# EAGLE design AmpSwitchAutomatic_control (EAGLE 6.0)
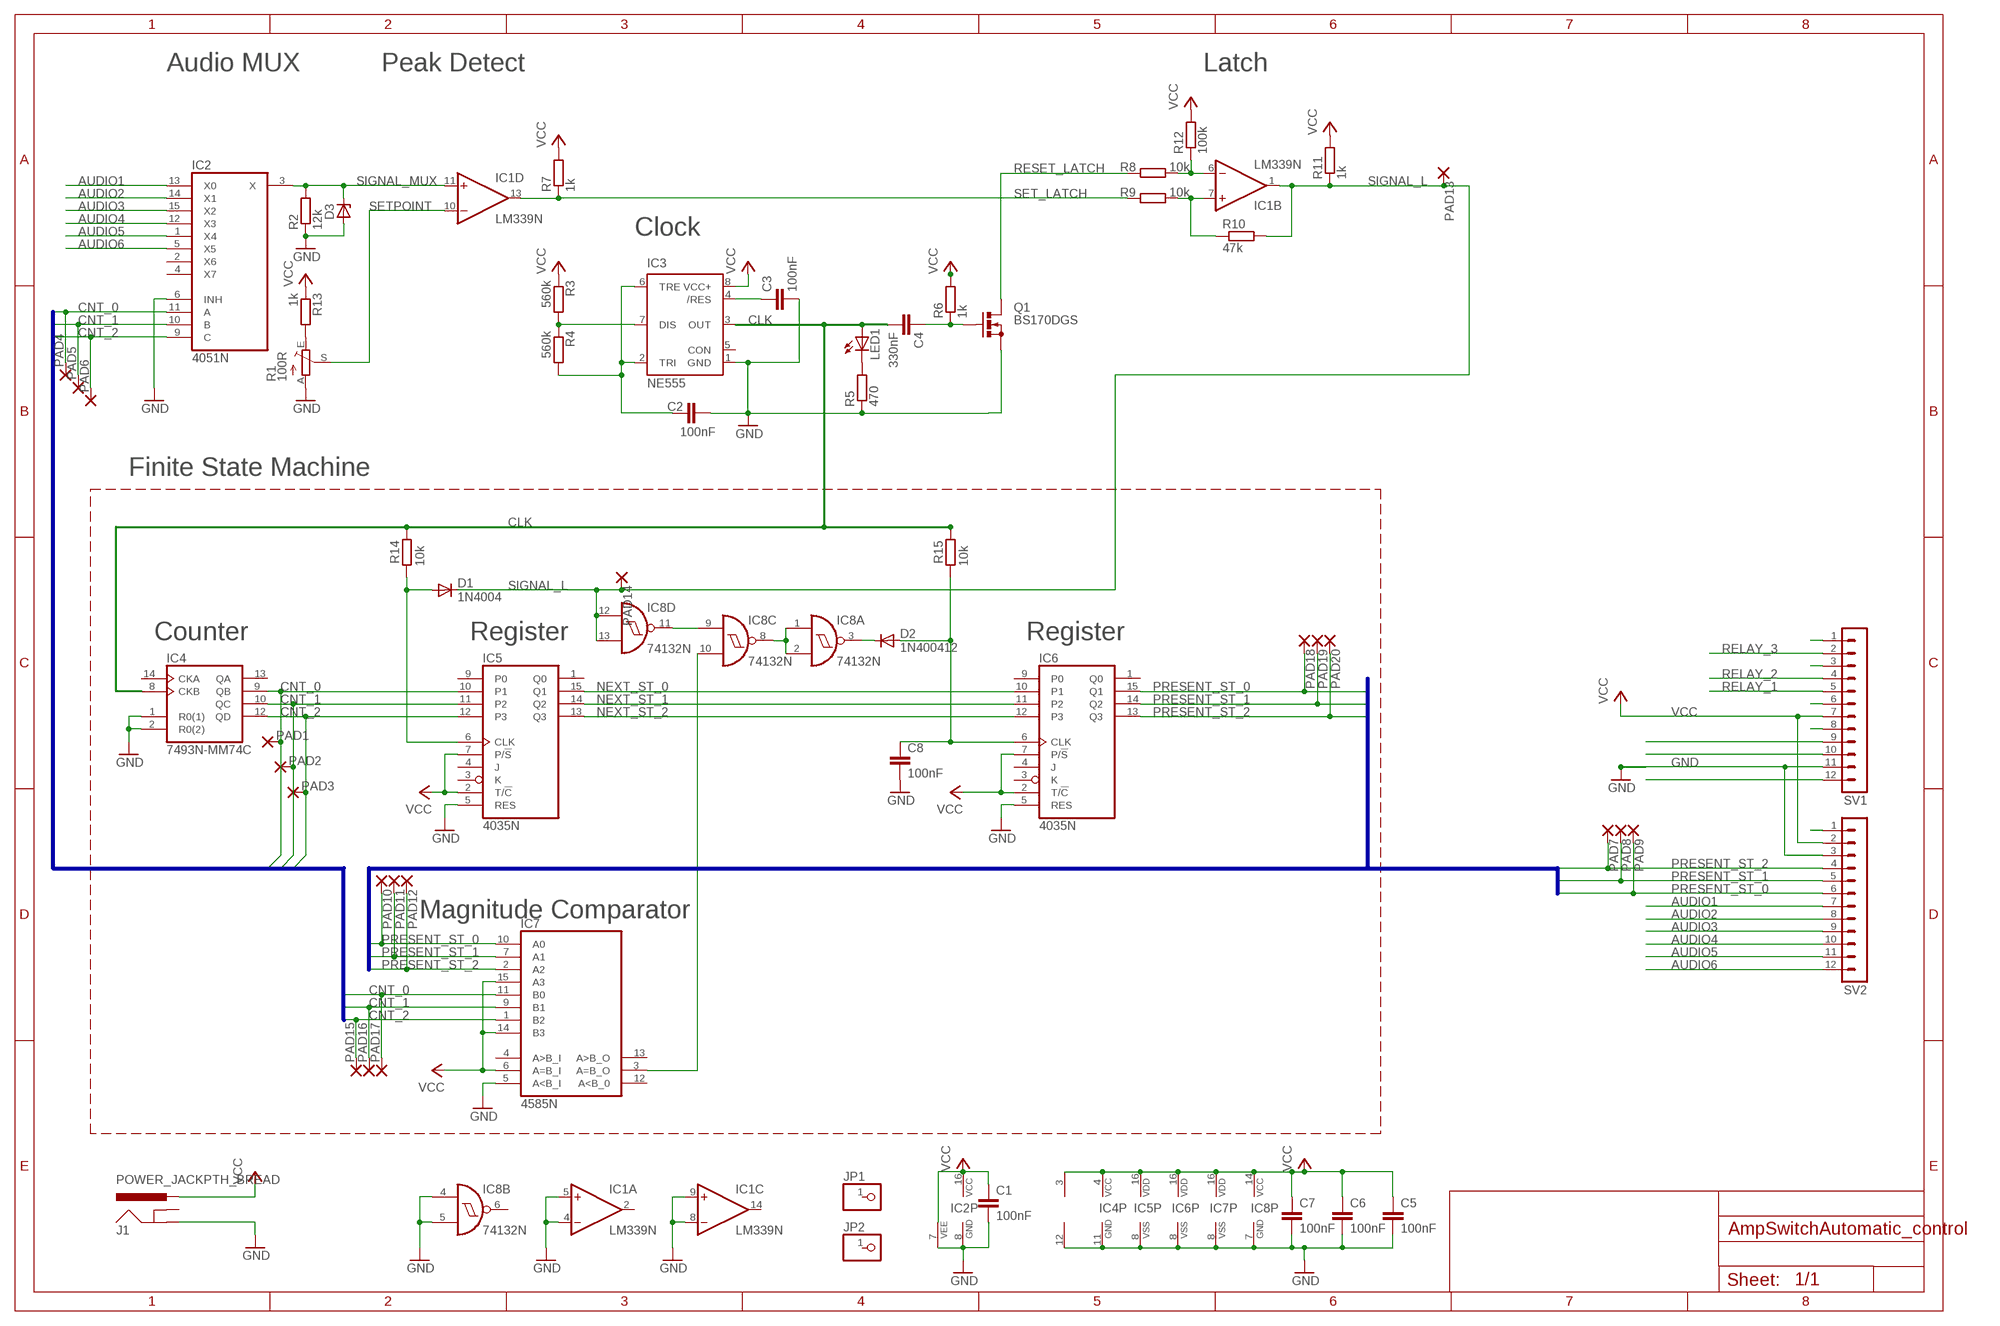
[diagram p0: schematic, sheet 1]

## Parts
C1  100nF  C-EU025-025X050  [C025-025X050]
C2  100nF  C-EU025-024X044  [C025-024X044]
C3  100nF  C-EU025-024X044  [C025-024X044]
C4  330nF  C-EU075-032X103  [C075-032X103]
C5  100nF  C-EU025-025X050  [C025-025X050]
C6  100nF  C-EU025-025X050  [C025-025X050]
C7  100nF  C-EU025-025X050  [C025-025X050]
C8  100nF  C-EU050-025X075  [C050-025X075]
D1  1N4004  [DO41-10]
D2  1N400412  [DO41-12]
D3  ZENER-DIODEDO35Z10  [DO35Z10]
IC1  LM339N  [DIL14]
IC2  4051N  [DIL16]
IC3  NE555  [DIL-08]
IC4  7493N-MM74C  [DIL14]
IC5  4035N  [DIL16]
IC6  4035N  [DIL16]
IC7  4585N  [DIL16]
IC8  74132N  [DIL14]
J1  POWER_JACKPTH_BREAD  [POWER_JACK_PTH_BREAD]
JP1  PINHD-1X1  [1X01]
JP2  PINHD-1X1  [1X01]
LED1  LED5MM  [LED5MM]
PAD1  WIREPAD1,6/0,9  [1,6/0,9]
PAD2  WIREPAD1,6/0,9  [1,6/0,9]
PAD3  WIREPAD1,6/0,9  [1,6/0,9]
PAD4  WIREPAD1,6/0,9  [1,6/0,9]
PAD5  WIREPAD1,6/0,9  [1,6/0,9]
PAD6  WIREPAD1,6/0,9  [1,6/0,9]
PAD7  WIREPAD1,6/0,9  [1,6/0,9]
PAD8  WIREPAD1,6/0,9  [1,6/0,9]
PAD9  WIREPAD1,6/0,9  [1,6/0,9]
PAD10  WIREPAD1,6/0,9  [1,6/0,9]
PAD11  WIREPAD1,6/0,9  [1,6/0,9]
PAD12  WIREPAD1,6/0,9  [1,6/0,9]
PAD13  WIREPAD1,6/0,9  [1,6/0,9]
PAD14  WIREPAD1,6/0,9  [1,6/0,9]
PAD15  WIREPAD1,6/0,9  [1,6/0,9]
PAD16  WIREPAD1,6/0,9  [1,6/0,9]
PAD17  WIREPAD1,6/0,9  [1,6/0,9]
PAD18  WIREPAD1,6/0,9  [1,6/0,9]
PAD19  WIREPAD1,6/0,9  [1,6/0,9]
PAD20  WIREPAD1,6/0,9  [1,6/0,9]
Q1  BS170DGS  [TO92-LINE]
R1  100R  TRIM_EU-B25P  [B25P]
R2  12k  R-EU_0207/10  [0207/10]
R3  560k  R-EU_0207/2V  [0207/2V]
R4  560k  R-EU_0207/2V  [0207/2V]
R5  470  R-EU_0207/15  [0207/15]
R6  1k  R-EU_0207/12  [0207/12]
R7  1k  R-EU_0207/5V  [0207/5V]
R8  10k  R-EU_0207/5V  [0207/5V]
R9  10k  R-EU_0207/15  [0207/15]
R10  47k  R-EU_0207/15  [0207/15]
R11  1k  R-EU_0207/5V  [0207/5V]
R12  100k  R-EU_0207/7  [0207/7]
R13  1k  R-EU_0207/7  [0207/7]
R14  10k  R-EU_0207/7  [0207/7]
R15  10k  R-EU_0207/2V  [0207/2V]
SV1  MA12-1  [MA12-1]
SV2  MA12-1  [MA12-1]

## Nets
AUDIO1: IC2.13(X0) SV2.7
AUDIO2: IC2.14(X1) SV2.8
AUDIO3: IC2.15(X2) SV2.9
AUDIO4: IC2.12(X3) SV2.10
AUDIO5: IC2.1(X4) SV2.11
AUDIO6: IC2.5(X5) SV2.12
CLK: C4.2 IC3.3(OUT) IC4.8(CKB) LED1.A R14.2 R15.2
CNT_0: IC2.11(A) IC4.9(QB) IC5.10(P1) IC7.11(B0) PAD1.1(P) PAD4.1(P) PAD17.1(P)
CNT_1: IC2.10(B) IC4.10(QC) IC5.11(P2) IC7.9(B1) PAD2.1(P) PAD5.1(P) PAD16.1(P)
CNT_2: IC2.9(C) IC4.12(QD) IC5.12(P3) IC7.1(B2) PAD3.1(P) PAD6.1(P) PAD15.1(P)
GND: C1.2 C2.2 C3.2 C5.2 C6.2 C7.2 C8.2 D3.A IC1.4(A:-IN) IC1.5(A:+IN) IC1.8(C:-IN) IC1.9(C:+IN) IC1.12(P:GND) IC2.6(INH) IC2.7(VEE) IC2.8(GND) IC3.1(GND) IC4.1(R0(1)) IC4.2(R0(2)) IC4.11(GND) IC5.5(RES) IC5.8(VSS) IC6.5(RES) IC6.8(VSS) IC7.5(A<B_I) IC7.8(VSS) IC8.4(B:I0) IC8.5(B:I1) IC8.7(P:GND) J1.GND Q1.3(S) R1.A R2.1 R5.1 SV1.11 SV2.3
N$1: R1.E R13.2
N$2: IC3.7(DIS) R3.2 R4.1
N$3: C2.1 IC3.2(TRI) IC3.6(TRE) R4.2
N$4: LED1.K(C) R5.2
N$5: C4.1 Q1.2(G) R6.1
N$6: IC1.6(B:-IN) R8.2 R12.1
N$7: IC1.7(B:+IN) R9.2 R10.1
N$8: SV1.1
N$9: C3.1 IC3.4(/RES)
N$10: SV1.3
N$11: SV1.6
N$12: SV1.8
N$13: SV1.9
N$14: SV1.10
N$15: SV1.12
N$17: D1.A IC5.6(CLK) R14.1
N$18: D2.C IC8.3(A:O)
N$19: SV2.1
N$20: C8.1 D2.A IC6.6(CLK) R15.1
N$21: IC7.3(A=B_O) IC8.10(C:I1)
N$22: IC8.1(A:I0) IC8.2(A:I1) IC8.8(C:O)
N$23: IC8.9(C:I0) IC8.11(D:O)
NEXT_ST_0: IC5.15(Q1) IC6.10(P1)
NEXT_ST_1: IC5.14(Q2) IC6.11(P2)
NEXT_ST_2: IC5.13(Q3) IC6.12(P3)
PRESENT_ST_0: IC6.15(Q1) IC7.10(A0) PAD9.1(P) PAD10.1(P) PAD18.1(P) SV2.6
PRESENT_ST_1: IC6.14(Q2) IC7.7(A1) PAD8.1(P) PAD11.1(P) PAD19.1(P) SV2.5
PRESENT_ST_2: IC6.13(Q3) IC7.2(A2) PAD7.1(P) PAD12.1(P) PAD20.1(P) SV2.4
RELAY_1: SV1.5
RELAY_2: SV1.4
RELAY_3: SV1.2
RESET_LATCH: Q1.1(D) R8.1
SET_LATCH: IC1.13(D:OUT) R7.1 R9.1
SETPOINT: IC1.10(D:-IN) R1.S
SIGNAL_L: D1.C IC1.1(B:OUT) IC8.12(D:I0) IC8.13(D:I1) PAD13.1(P) PAD14.1(P) R10.2 R11.1
SIGNAL_MUX: D3.C IC1.11(D:+IN) IC2.3(X) R2.2
VCC: C1.1 C5.1 C6.1 C7.1 IC1.3(P:V+) IC2.16(VCC) IC3.8(VCC+) IC4.4(VCC) IC5.2(T/!C) IC5.7(P/!S) IC5.16(VDD) IC6.2(T/!C) IC6.7(P/!S) IC6.16(VDD) IC7.6(A=B_I) IC7.14(B3) IC7.15(A3) IC7.16(VDD) IC8.14(P:VCC) J1.PWR R3.1 R6.2 R7.2 R11.2 R12.2 R13.1 SV1.7 SV2.2
Unconnected: IC1.2(A:OUT) IC1.14(C:OUT) IC2.2(X6) IC2.4(X7) IC3.5(CON) IC4.13(QA) IC4.14(CKA) IC5.1(Q0) IC5.3(K) IC5.4(J) IC5.9(P0) IC6.1(Q0) IC6.3(K) IC6.4(J) IC6.9(P0) IC7.4(A>B_I) IC7.12(A<B_0) IC7.13(A>B_O) IC8.6(B:O) J1.GNDBREAK JP1.1 JP2.1

## Buses
CNT_[0..2]
PRESENT_ST_[0..2]

## Notes on the sheet
- Audio MUX | Peak Detect | Latch
- Clock
- Finite State Machine
- Counter | Register | Register
- Magnitude Comparator

## Library data of the parts
C1-C8 = rcl:C-EU: CAPACITOR, European symbol
D1 D2 = diode:1N4004: DIODE general purpose rectifier, 1 A
D3 = diode:ZENER-DIODE: Z-Diode
IC1 = linear:LM339: Low Power Low Offset Voltage Quad Comparators with open collector; LM139/LM239/LM339/LM2901/LM3302
IC2 = 40xx:4051: 8-channel ANALOG MULTIPLEXER
IC3 = st-microelectronics:NE555: General purpose bipolar Timer; MF: Arrow Electronics; MPN: NE555N; OC_FARNELL: 1467742; OC_NEWARK: 89K1486
IC4 = 74xx-eu:74*93: Decade, divide by twelve and binary COUNTER
IC5 IC6 = 40xx:4035: 4-bit parallel in/out SHIFT REGISTER
IC7 = 45xx:4585: 4-bit COMPARATOR (MC14585BCP)
IC8 = 74xx-eu:74*132: Quad 2-input NAND schmitt trigger
J1 = SparkFun-Connectors:POWER_JACK: Power Jack Connector This is the standard 5.5mm barrel jack for power. The PTH is the most common, proven, reliable, footprint. The Slot footprint only works if the mill layer is transmitted to the PCB fab house so be warned. Here are the connectors we sell at SparkFun: DC Barrel Power Jack/Connector <https://www.sparkfun.com/products/119> (PRT-00119) DC Barrel Power Jack/Connector (SMD) <https://www.sparkfun.com/products/12748> (PRT-12748) DC Barrel Jack Adapter - Breadboard Compatible <https://www.sparkfun.com/products/10811> (PRT-10811) It is used on this SparkFun product (and many, many others): SparkFun RedBoard - Programmed with Arduino <https://www.sparkfun.com/products/12757> (DEV-12757) Also, if you need a mating power supply or connector, please check these out: Wall Adapter Power Supply - 9VDC 650mA <https://www.sparkfun.com/products/298> (TOL-00298) DC Barrel Jack Adapter - Male <https://www.sparkfun.com/products/10287> (PRT-10287); PROD_ID: PRT-10811
JP1 JP2 = pinhead:PINHD-1X1: PIN HEADER
LED1 = led:LED: LED OSRAM: - CHIPLED LG R971, LG N971, LY N971, LG Q971, LY Q971, LO R971, LY R971 LH N974, LH R974 LS Q976, LO Q976, LY Q976 LO Q996 - Hyper CHIPLED LW Q18S LB Q993, LB Q99A, LB R99A - SideLED LS A670, LO A670, LY A670, LG A670, LP A670 LB A673, LV A673, LT A673, LW A673 LH A674 LY A675 LS A676, LA A676, LO A676, LY A676, LW A676 LS A679, LY A679, LG A679 - Hyper Micro SIDELED® LS Y876, LA Y876, LO Y876, LY Y876 LT Y87S - SmartLED LW L88C, LW L88S LB L89C, LB L89S, LG L890 LS L89K, LO L89K, LY L89K LS L896, LA L896, LO L896, LY L896 - TOPLED LS T670, LO T670, LY T670, LG T670, LP T670 LSG T670, LSP T670, LSY T670, LOP T670, LYG T670 LG T671, LOG T671, LSG T671 LB T673, LV T673, LT T673, LW T673 LH T674 LS T676, LA T676, LO T676, LY T676, LB T676, LH T676, LSB T676, LW T676 LB T67C, LV T67C, LT T67C, LS T67K, LO T67K, LY T67K, LW E67C LS E67B, LA E67B, LO E67B, LY E67B, LB E67C, LV E67C, LT E67C LW T67C LS T679, LY T679, LG T679 LS T770, LO T770, LY T770, LG T770, LP T770 LB T773, LV T773, LT T773, LW T773 LH T774 LS E675, LA E675, LY E675, LS T675 LS T776, LA T776, LO T776, LY T776, LB T776 LHGB T686 LT T68C, LB T68C - Hyper Mini TOPLED® LB M676 - Mini TOPLED Santana® LG M470 LS M47K, LO M47K, LY M47K Source: http://www.osram.convergy.de LUXEON: - LUMILED® LXK2-PW12-R00, LXK2-PW12-S00, LXK2-PW14-U00, LXK2-PW14-V00 LXK2-PM12-R00, LXK2-PM12-S00, LXK2-PM14-U00 LXK2-PE12-Q00, LXK2-PE12-R00, LXK2-PE12-S00, LXK2-PE14-T00, LXK2-PE14-U00 LXK2-PB12-K00, LXK2-PB12-L00, LXK2-PB12-M00, LXK2-PB14-N00, LXK2-PB14-P00, LXK2-PB14-Q00 LXK2-PR12-L00, LXK2-PR12-M00, LXK2-PR14-Q00, LXK2-PR14-R00 LXK2-PD12-Q00, LXK2-PD12-R00, LXK2-PD12-S00 LXK2-PH12-R00, LXK2-PH12-S00 LXK2-PL12-P00, LXK2-PL12-Q00, LXK2-PL12-R00 Source: www.luxeon.com KINGBRIGHT: KA-3528ASYC Source: www.kingbright.com
PAD1-PAD20 = wirepad:WIREPAD: Wire PAD connect wire on PCB
Q1 = transistor-small-signal:BS170: N-CHANNEL MOS FET
R1 = pot:TRIM_EU-: POTENTIOMETER
R2-R15 = rcl:R-EU_: RESISTOR, European symbol
SV1 SV2 = con-lstb:MA12-1: PIN HEADER; OC_FARNELL: unknown; OC_NEWARK: unknown

## Board
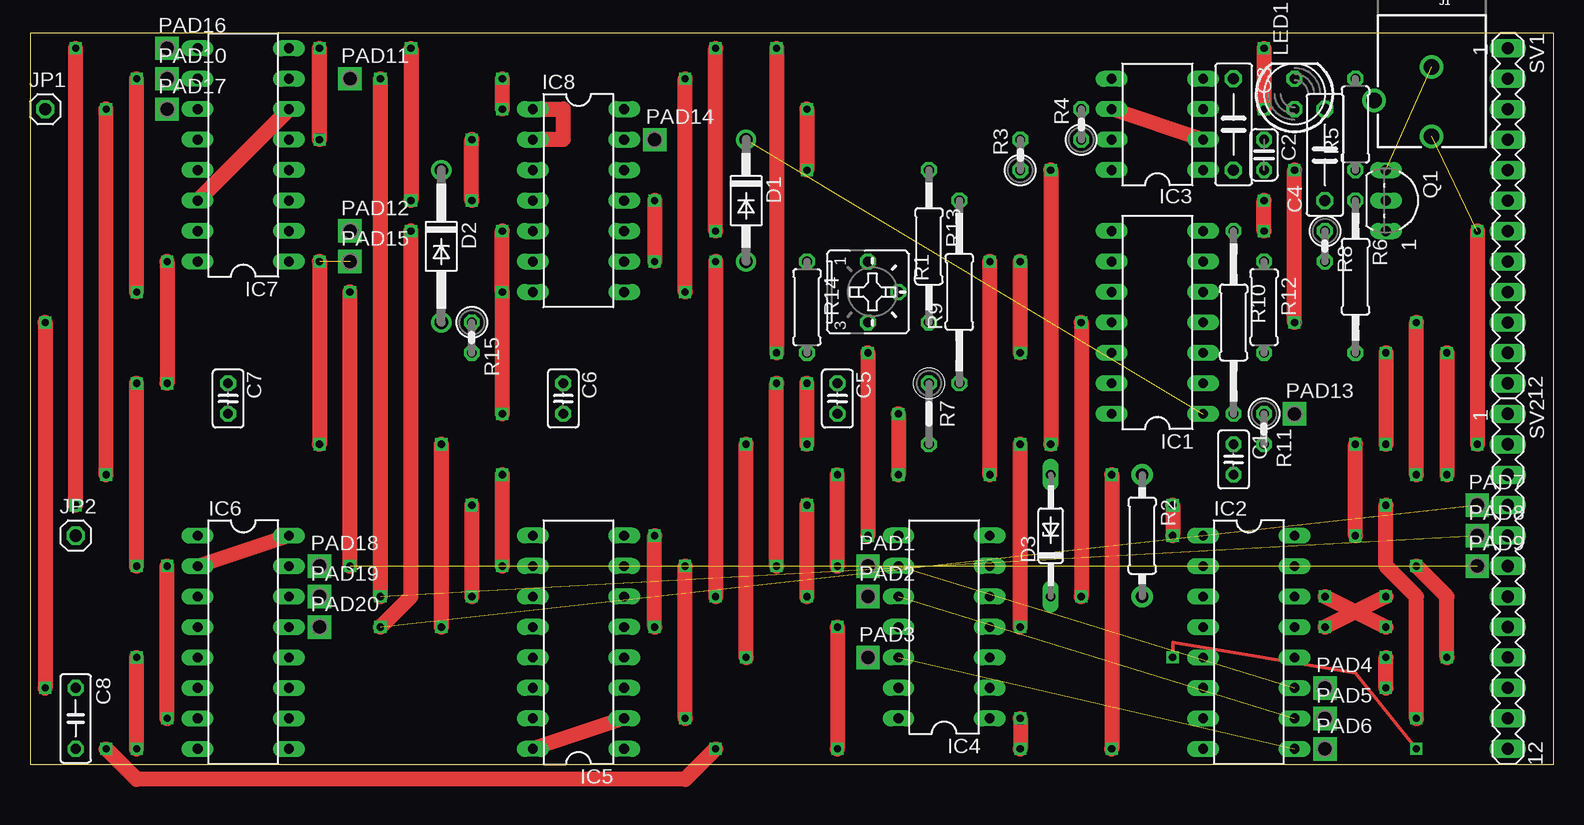
[diagram p1: board, top side]
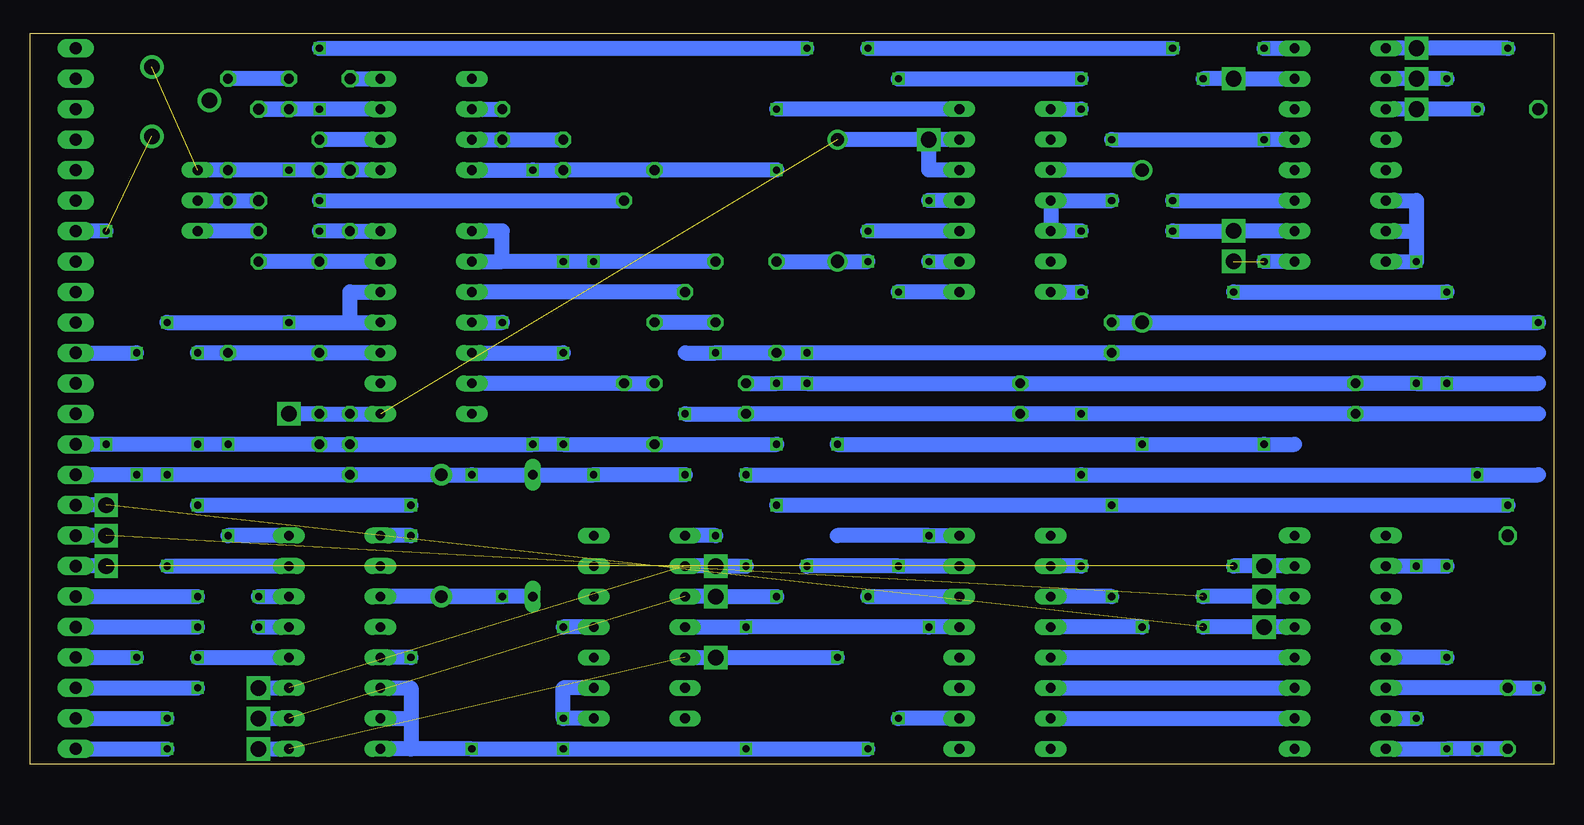
[diagram p2: board, bottom side, seen from below]

Size 127 x 60.96 mm. Coordinates in mm from the lower left corner, seen from the top.
Outline: 0,0 127,0 127,60.96 0,60.96 0,0
Copper layers (1*16): Top 0.035mm / dielectric 1.5mm / Bottom 0.035mm
Design rules: minimum track width 10mil, minimum drill 24mil, track to track 8mil, track to pad 8mil, pad to pad 8mil, via to via 8mil, smd to smd 8mil, copper to edge 40mil, drill to drill 8mil, minimum pad ring 10mil, minimum via ring 8mil, stop-mask expansion 4mil, vias tented up to drill 0mil, thermal gap 10mil

### Footprints (pad centres in the part's own frame; a part is rotated, then mirrored left to right if it is on the bottom)
C025-025X050 = drill 0.813 octagon: 1 -1.27,0; 2 1.27,0
C025-024X044 = drill 0.813 octagon: 1 -1.27,0; 2 1.27,0
C075-032X103 = drill 0.914 octagon: 1 -3.81,0; 2 3.81,0
C050-025X075 = drill 0.813 octagon: 1 -2.54,0; 2 2.54,0
DO41-10 = drill 1.118: A 5.08,0; C -5.08,0
DO41-12 = drill 1.118: A 6.35,0; C -6.35,0
DO35Z10 = drill 0.813 long: A 5.08,0; C -5.08,0
DIL14 = drill 0.813 long: 1 -7.62,-3.81; 2 -5.08,-3.81; 3 -2.54,-3.81; 4 0,-3.81; 5 2.54,-3.81; 6 5.08,-3.81; 7 7.62,-3.81; 8 7.62,3.81; 9 5.08,3.81; 10 2.54,3.81; 11 0,3.81; 12 -2.54,3.81; 13 -5.08,3.81; 14 -7.62,3.81
DIL16 = drill 0.813 long: 1 -8.89,-3.81; 2 -6.35,-3.81; 3 -3.81,-3.81; 4 -1.27,-3.81; 5 1.27,-3.81; 6 3.81,-3.81; 7 6.35,-3.81; 8 8.89,-3.81; 9 8.89,3.81; 10 6.35,3.81; 11 3.81,3.81; 12 1.27,3.81; 13 -1.27,3.81; 14 -3.81,3.81; 15 -6.35,3.81; 16 -8.89,3.81
DIL-08 = drill 0.813 long: 1 -3.81,-3.81; 2 -1.27,-3.81; 3 1.27,-3.81; 4 3.81,-3.81; 5 3.81,3.81; 6 1.27,3.81; 7 -1.27,3.81; 8 -3.81,3.81
POWER_JACK_PTH_BREAD = drill 1.3: GND 0,7.9; GNDBREAK 4.8,10.7; PWR 0,13.7
1X01 = drill 1.016 octagon: 1 0,0
LED5MM = drill 0.813 octagon: A -1.27,0; K 1.27,0
1,6/0,9 = drill 1.3 square: 1 0,0
TO92-LINE = drill 0.813 long: 1 2.54,0; 2 0,0; 3 -2.54,0
B25P = drill 0.813 octagon: A -2.54,0; E 2.54,0; S 0,2.54
0207/10 = drill 1.016 pad 1.778: 1 -5.08,0; 2 5.08,0
0207/2V = drill 0.813 octagon: 1 -1.27,0; 2 1.27,0
0207/7 = drill 0.813 octagon: 1 -3.81,0; 2 3.81,0
0207/12 = drill 0.813 octagon: 1 -6.35,0; 2 6.35,0
0207/5V = drill 0.813 octagon: 1 -2.54,0; 2 2.54,0
0207/15 = drill 0.813 octagon: 1 -7.62,0; 2 7.62,0
MA12-1 = drill 1.016 long: 1 -13.97,0; 2 -11.43,0; 3 -8.89,0; 4 -6.35,0; 5 -3.81,0; 6 -1.27,0; 7 1.27,0; 8 3.81,0; 9 6.35,0; 10 8.89,0; 11 11.43,0; 12 13.97,0

### Placement (x,y rotation side)
C1  100.33,25.4 270 top
C2  102.87,50.8 270 top
C3  100nF  [C075-032X103]  100.33,53.34 270 top
C4  107.95,50.8 90 top
C5  67.31,30.48 270 top
C6  44.45,30.48 270 top
C7  16.51,30.48 270 top
C8  3.81,3.81 270 top
D1  59.69,46.99 270 top
D2  34.29,43.18 270 top
D3  85.09,19.05 90 top
IC1  93.98,36.83 90 top
IC2  101.6,10.16 270 top
IC3  93.98,53.34 90 top
IC4  76.2,11.43 90 top
IC5  45.72,10.16 90 top
IC6  17.78,10.16 270 top
IC7  17.78,50.8 90 top
IC8  45.72,46.99 270 top
J1  116.84,66.04 180 top
JP1  1.27,54.61 0 top
JP2  3.81,19.05 0 top
LED1  105.41,55.88 90 top
PAD1  69.85,16.51 0 top
PAD2  69.85,13.97 0 top
PAD3  69.85,8.89 0 top
PAD4  107.95,6.35 0 top
PAD5  107.95,3.81 0 top
PAD6  107.95,1.27 0 top
PAD7  120.65,21.59 0 top
PAD8  120.65,19.05 0 top
PAD9  120.65,16.51 0 top
PAD10  11.43,57.15 0 top
PAD11  26.67,57.15 0 top
PAD12  26.67,44.45 0 top
PAD13  105.41,29.21 0 top
PAD14  52.07,52.07 0 top
PAD15  26.67,41.91 0 top
PAD16  11.43,59.69 0 top
PAD17  11.43,54.61 0 top
PAD18  24.13,16.51 0 top
PAD19  24.13,13.97 0 top
PAD20  24.13,11.43 0 top
Q1  113.03,46.99 270 top
R1  69.85,39.37 270 top
R2  92.71,19.05 270 top
R3  82.55,50.8 90 top
R4  87.63,53.34 90 top
R5  470  [0207/7]  110.49,53.34 90 top
R6  110.49,40.64 270 top
R7  74.93,29.21 270 top
R8  10k  [0207/2V]  107.95,43.18 270 top
R9  77.47,39.37 90 top
R10  100.33,36.83 270 top
R11  1k  [0207/2V]  102.87,27.94 270 top
R12  102.87,38.1 270 top
R13  1k  [0207/12]  74.93,43.18 270 top
R14  64.77,38.1 270 top
R15  36.83,35.56 270 top
SV1  123.19,45.72 270 top
SV2  123.19,15.24 270 top

### Tracks (layer width: path | path; a pad name or v marks a point on that pad's centre or on a via)
AUDIO1  (via drill 0.6)
  Top 1.27: v113.03,13.97 v107.95,11.43
  Bottom 1.27: SV2.7 v113.03,13.97 | v107.95,11.43 IC2.13
AUDIO2  (via drill 0.6)
  Top 1.27: v113.03,11.43 v107.95,13.97
  Bottom 1.27: SV2.8 v113.03,11.43 | v107.95,13.97 IC2.14
AUDIO3  (via drill 0.6)
  Top 1.27: v118.11,8.89 118.11,13.97 v115.57,16.51
  Bottom 1.27: SV2.9 v118.11,8.89 | v115.57,16.51 IC2.15
AUDIO4  (via drill 0.6)
  Top 1.27: v113.03,6.35 v113.03,8.89
  Bottom 1.27: SV2.10 v113.03,6.35 | v113.03,8.89 IC2.12
AUDIO5  (via drill 0.6)
  Top 1.27: v115.57,3.81 115.57,13.97 113.03,16.51 v113.03,21.59 | v95.25,21.59 v95.25,19.05
  Bottom 1.27: SV2.11 v115.57,3.81 | v113.03,21.59 v95.25,21.59 | v95.25,19.05 IC2.1
AUDIO6  (via drill 0.6)
  Top 0.305: v115.57,1.27 110.49,7.62 95.25,10.16 v95.25,8.89
  Bottom 1.27: SV2.12 v115.57,1.27 | v95.25,8.89 IC2.5
CLK  (via drill 0.6)
  Top 1.27: v102.87,59.69 v102.87,54.61 | v62.23,59.69 v62.23,34.29 | v69.85,34.29 v69.85,19.05
  Bottom 1.27: IC3.3 v102.87,54.61 C4.2 LED1.A | 1.27,34.29 R15.2 v62.23,34.29 R14.2 v69.85,34.29 72.39,34.29 | v102.87,59.69 v62.23,59.69 | v69.85,19.05 IC4.8
CNT_0  (via drill 0.6)  (1 unrouted)
  Top 1.27: v67.31,16.51 v67.31,24.13 | v39.37,24.13 v39.37,16.51 | v6.35,24.13 v6.35,54.61
  Bottom 1.27: PAD4.1 IC2.11 | IC4.9 PAD1.1 v67.31,16.51 | v67.31,24.13 v39.37,24.13 v6.35,24.13 1.27,24.13 | v39.37,16.51 IC5.10 | v6.35,54.61 PAD17.1 IC7.11
CNT_1  (via drill 0.6)  (1 unrouted)
  Top 1.27: v64.77,13.97 v64.77,21.59 | v36.83,21.59 v36.83,13.97 | v3.81,21.59 v3.81,59.69
  Bottom 1.27: PAD5.1 IC2.10 | IC4.10 PAD2.1 v64.77,13.97 | v64.77,21.59 v36.83,21.59 v3.81,21.59 | v36.83,13.97 IC5.11 | v3.81,59.69 PAD16.1 IC7.9
CNT_2  (via drill 0.6)  (2 unrouted)
  Top 1.27: v59.69,8.89 v59.69,26.67 | v34.29,26.67 v34.29,11.43 | v24.13,41.91 v24.13,26.67
  Bottom 1.27: PAD6.1 IC2.9 | IC4.12 PAD3.1 v59.69,8.89 | v59.69,26.67 v34.29,26.67 v24.13,26.67 21.59,26.67 | v34.29,11.43 IC5.12 | IC7.1 v24.13,41.91
GND  (via drill 0.6)  (1 unrouted)
  Top 1.27: v115.57,24.13 v115.57,36.83 | v118.11,34.29 v118.11,24.13 | v105.41,36.83 v105.41,49.53 | v90.17,24.13 v90.17,1.27 | v82.55,3.81 v82.55,1.27 | v67.31,11.43 v67.31,1.27 | v82.55,34.29 v82.55,41.91 | v80.01,24.13 v80.01,41.91 | v72.39,29.21 v72.39,24.13 | v52.07,11.43 v52.07,19.05 | v8.89,1.27 v8.89,8.89 | v39.37,29.21 v39.37,39.37 v39.37,44.45 | v36.83,46.99 v36.83,52.07 | v24.13,52.07 v24.13,59.69 | v57.15,1.27 54.61,-1.27 8.89,-1.27 v6.35,1.27
  Bottom 1.27: R2.1 C1.2 v115.57,24.13 v118.11,24.13 SV2.3 | IC3.1 C3.2 C2.2 v105.41,49.53 R5.1 Q1.3 | 100.33,36.83 100.33,39.37 IC1.5 | v115.57,36.83 v105.41,36.83 100.33,36.83 | SV1.11 v118.11,34.29 | 100.33,36.83 IC1.4 | R1.A v80.01,41.91 v82.55,41.91 87.63,41.91 | IC1.8 87.63,44.45 87.63,41.91 | D3.A v90.17,24.13 R2.1 | D3.A v80.01,24.13 v72.39,24.13 | R2.1 D3.A | 95.25,1.27 v90.17,1.27 v82.55,1.27 v67.31,1.27 v57.15,1.27 | 95.25,1.27 IC2.8 | IC2.7 95.25,3.81 | 95.25,3.81 95.25,1.27 | IC2.6 95.25,6.35 95.25,3.81 | IC4.2 82.55,6.35 v82.55,3.81 IC4.1 | IC4.11 v67.31,11.43 v52.07,11.43 IC5.5 | 1.27,29.21 C7.2 v39.37,29.21 C6.2 C5.2 v72.39,29.21 | IC1.9 87.63,41.91 | IC1.12 v82.55,34.29 | 59.69,19.05 v52.07,19.05 IC5.8 | IC6.8 v8.89,1.27 v6.35,1.27 C8.2 | v8.89,8.89 IC6.5 | IC8.7 v39.37,39.37 | v39.37,44.45 IC8.5 IC8.4 v36.83,46.99 | v36.83,52.07 v24.13,52.07 IC7.5 | v24.13,59.69 IC7.8
  other vias: 69.85,41.91
N$1
  Bottom 1.27: R1.E R13.2
N$2
  Bottom 1.27: IC3.7 R4.1 R3.2
N$3
  Top 1.27: IC3.2 IC3.6
  Bottom 1.27: IC3.2 C2.1 | IC3.6 R4.2
N$4
  Bottom 1.27: LED1.K R5.2
N$5
  Bottom 1.27: C4.1 R6.1 Q1.2
N$6
  Bottom 1.27: IC1.6 R12.1 R8.2
N$7  (via drill 0.6)
  Top 1.27: v102.87,44.45 v102.87,46.99
  Bottom 1.27: v102.87,44.45 R10.1 IC1.7 | v102.87,46.99 R9.2
N$9
  Bottom 1.27: C3.1 IC3.4
N$17  (via drill 0.6)
  Top 1.27: v57.15,41.91 v57.15,13.97
  Bottom 1.27: v57.15,41.91 R14.1 D1.A | v57.15,13.97 IC5.6
N$18
  Bottom 1.27: D2.C IC8.3
N$20  (via drill 0.6)
  Top 1.27: v1.27,36.83 v1.27,6.35
  Bottom 1.27: D2.A R15.1 v1.27,36.83 | IC6.6 C8.1 v1.27,6.35
N$21  (via drill 0.6)
  Top 1.27: v57.15,44.45 v57.15,59.69 | v31.75,59.69 v31.75,46.99
  Bottom 1.27: IC8.10 v57.15,44.45 | v57.15,59.69 v31.75,59.69 | v31.75,46.99 IC7.3
N$22  (via drill 0.6)
  Top 1.27: v54.61,39.37 v54.61,57.15 | v39.37,57.15 v39.37,54.61 | IC8.1 44.45,54.61 44.45,52.07 IC8.2
  Bottom 1.27: IC8.8 v54.61,39.37 | v54.61,57.15 v39.37,57.15 | IC8.1 v39.37,54.61
N$23  (via drill 0.6)
  Top 1.27: v52.07,46.99 v52.07,41.91
  Bottom 1.27: IC8.11 v52.07,46.99 | v52.07,41.91 IC8.9
NEXT_ST_0
  Bottom 1.27: IC5.15 IC6.10
NEXT_ST_1
  Bottom 1.27: IC5.14 IC6.11
NEXT_ST_2
  Bottom 1.27: IC5.13 IC6.12
PRESENT_ST_0  (via drill 0.6)  (1 unrouted)
  Top 1.27: v26.67,16.51 v26.67,39.37 | v8.89,39.37 v8.89,57.15
  Bottom 1.27: PAD9.1 SV2.6 | IC6.15 PAD18.1 v26.67,16.51 | v26.67,39.37 v8.89,39.37 | v8.89,57.15 PAD10.1 IC7.10
PRESENT_ST_1  (via drill 0.6)  (1 unrouted)
  Top 1.27: v29.21,13.97 v29.21,57.15
  Bottom 1.27: PAD8.1 SV2.5 | v29.21,13.97 PAD19.1 IC6.14 | IC7.7 PAD11.1 v29.21,57.15
PRESENT_ST_2  (via drill 0.6)  (1 unrouted)
  Top 1.27: v29.21,11.43 31.75,13.97 v31.75,44.45
  Bottom 1.27: PAD7.1 SV2.4 | v29.21,11.43 PAD20.1 IC6.13 | v31.75,44.45 PAD12.1 IC7.2
RESET_LATCH
  Bottom 1.27: R8.1 Q1.1
SET_LATCH
  Bottom 1.27: R7.1 R9.1 IC1.13
SETPOINT
  Bottom 1.27: R1.S IC1.10
SIGNAL_L  (1 unrouted)
  Bottom 1.27: IC1.1 R10.2 R11.1 PAD13.1 | IC8.13 PAD14.1 | IC8.12 52.07,49.53 PAD14.1 | PAD14.1 D1.C
SIGNAL_MUX  (via drill 0.6)
  Top 1.27: v87.63,36.83 v87.63,13.97
  Bottom 1.27: IC1.11 v87.63,36.83 | v87.63,13.97 IC2.3 | R2.2 v87.63,13.97 | D3.C v87.63,13.97
VCC  (via drill 0.6)  (1 unrouted)
  Top 1.27: v113.03,34.29 v113.03,26.67 | v85.09,49.53 v85.09,26.67 | v120.65,44.45 v120.65,26.67 | v110.49,19.05 v110.49,26.67 | v64.77,26.67 v64.77,31.75 | v54.61,3.81 v54.61,16.51 | v82.55,11.43 v82.55,26.67 | IC5.2 IC5.16 | v62.23,16.51 v62.23,31.75 | IC6.2 IC6.16 | v8.89,16.51 v8.89,31.75 | v11.43,41.91 v11.43,31.75 | IC7.14 IC7.6 | v11.43,3.81 v11.43,16.51 | v64.77,54.61 v64.77,49.53
  Bottom 0.406: C1.1 v113.03,26.67
  Bottom 1.27: R6.2 v113.03,34.29 R12.2 IC1.3 | v110.49,26.67 v113.03,26.67 | v113.03,26.67 v120.65,26.67 SV2.2 | v113.03,26.67 R11.2 C1.1 v85.09,26.67 v82.55,26.67 R7.2 v64.77,26.67 | v85.09,49.53 IC3.8 R3.1 v64.77,49.53 R13.1 | v120.65,44.45 SV1.7 | IC2.16 v110.49,19.05 | IC4.4 v82.55,11.43 | v11.43,31.75 1.27,31.75 | IC5.2 v54.61,3.81 | IC5.7 v54.61,16.51 v62.23,16.51 | IC6.2 v11.43,16.51 v8.89,16.51 | IC7.16 v11.43,41.91 11.43,44.45 | v11.43,31.75 v8.89,31.75 | IC7.15 11.43,44.45 | IC7.14 11.43,46.99 11.43,44.45 | IC6.7 v11.43,3.81 | IC8.14 v64.77,54.61 | v11.43,31.75 C7.1 C6.1 v62.23,31.75 v64.77,31.75 C5.1

### Text on the board
tOrigins: CLK | VCC | GND | VCC | GND | BodgeWire